# Altium schematic sheet FULL_CB_Plugs_REV_D.SchDoc
size A4; DrawnBy: Philip Rowse
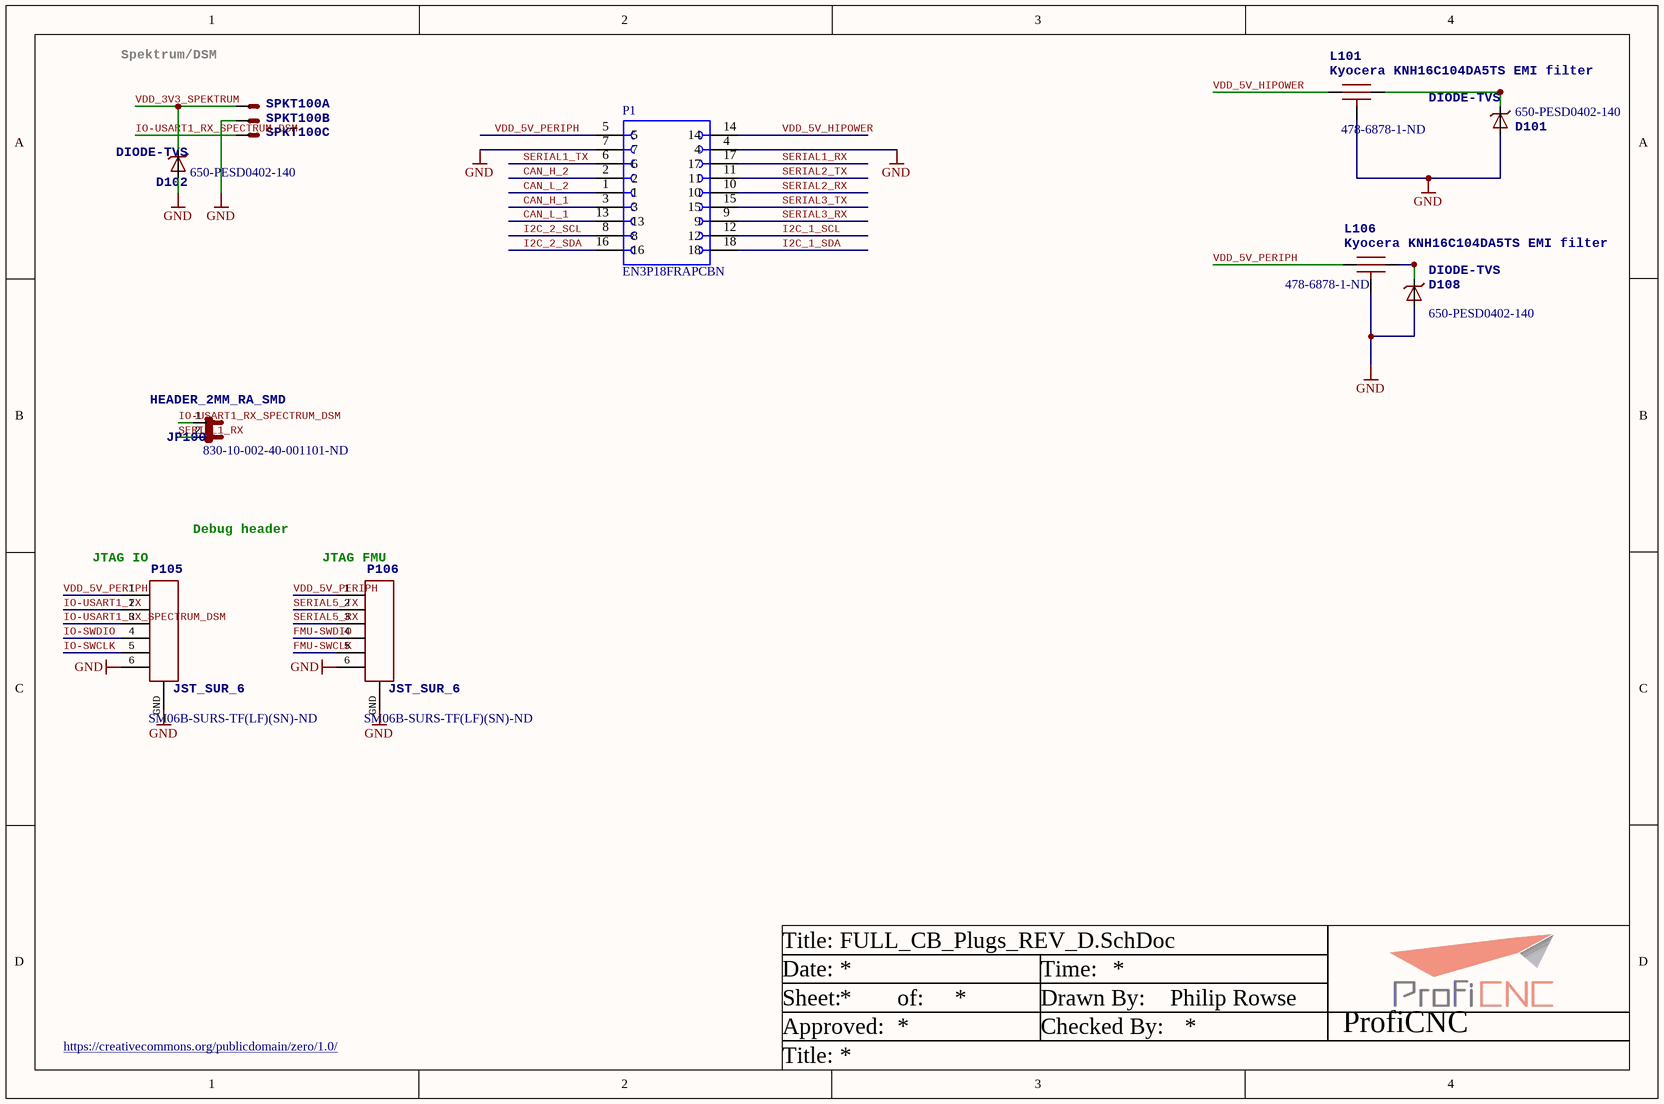
[diagram p0: FULL_CB_Plugs_REV_D.SchDoc]

## Parts
D101  DIODE-TVS  Supplier Part Number 1: 650-PESD0402-140  [0402-TVS]
D102  DIODE-TVS  Supplier Part Number 1: 650-PESD0402-140  [0402-TVS]
D108  DIODE-TVS  Supplier Part Number 1: 650-PESD0402-140  [0402-TVS]
JP100  HEADER_2MM_RA_SMD  Supplier Part Number 1: 830-10-002-40-001101-ND  [HEADER_2MM_RA_2]
L101  Kyocera KNH16C104DA5TS EMI filter  Supplier Part Number 1: 478-6878-1-ND  [KYOCERA-KNH16-DA]
L106  Kyocera KNH16C104DA5TS EMI filter  Supplier Part Number 1: 478-6878-1-ND  [KYOCERA-KNH16-DA]
P1  EN3P18FRAPCBN  [SWITCHCRAFT_EN3P18FRAPCBN]
P105  JST_SUR_6  Supplier Part Number 1: SM06B-SURS-TF(LF)(SN)-ND  [JST_SUR_H6]
P106  JST_SUR_6  Supplier Part Number 1: SM06B-SURS-TF(LF)(SN)-ND  [JST_SUR_H6]
SPKT100  CONN_SPEKTRUM_RX-TH  [B3B-ZR]  (value not drawn)  (parts A,B,C of 3)

## Nets
GND: D101.A D102.A D108.A L101.GND L106.GND P1.4 P1.7 P105.6 P105.GND P106.6 P106.GND SPKT100.2(S)
CAN_H_1: P1.3
CAN_H_2: P1.2
CAN_L_1: P1.13
CAN_L_2: P1.1
FMU-SWCLK: P106.5
FMU-SWDIO: P106.4
I2C_1_SCL: P1.12
I2C_1_SDA: P1.18
I2C_2_SCL: P1.8
I2C_2_SDA: P1.16
IO-SWCLK: P105.5
IO-SWDIO: P105.4
IO-USART1_RX_SPECTRUM_DSM: JP100.1 P105.3 SPKT100.1(S)
IO-USART1_TX: P105.2
SERIAL1_RX: JP100.2 P1.17
SERIAL1_TX: P1.6
SERIAL2_RX: P1.10
SERIAL2_TX: P1.11
SERIAL3_RX: P1.9
SERIAL3_TX: P1.15
SERIAL5_RX: P106.3
SERIAL5_TX: P106.2
VDD_3V3_SPEKTRUM: D102.C SPKT100.3(S)
VDD_5V_HIPOWER: L101.P$1 P1.14
VDD_5V_PERIPH: L106.P$1 P1.5 P105.1 P106.1
NetD101_C: D101.C L101.P$2
NetD108_C: D108.C L106.P$2

## Notes on the sheet
- Spektrum/DSM
- Debug header
- (near P105) JTAG IO
- (near P106) JTAG FMU
- Title:
- Date:
- Time:
- https://creativecommons.org/publicdomain/zero/1.0/
- Sheet:
- Approved:
- of:
- Drawn By:
- Checked By:
- ProfiCNC

## Library data of the parts
D101 D102 D108 = DIODE-TVS: Diode, TVS, 14VWM, 40VC, 0402, SMD; Supplier 1: Mouser
JP100 = HEADER_2MM_RA_SMD: Connector, PCB, 2MM, 2Pos, R/A, SMD, Au; Supplier 1: Digi-Key
L101 L106 = KNH16C104DA5TS: Capacitor, Filter, 0.1uF, 25V, 2A, 0603, SMD; Supplier 1: Digi-Key
P105 P106 = JST_SUR_6: Connector, Header, 6Pos, .8mm IDC, R/A, SMD, Tin; Supplier 1: Digi-Key
SPKT100 = CONN_SPEKTRUM_RX-TH: Spektrum RX connector; JST ZH series S3B-ZR-SM4A-TF; PARTNO: B3B-ZR(LF)(SN)
P1 = EN3P18FRAPCBN: Package: None; Price: None; Value: *; MP: EN3P18FRAPCBN; Availability: Unavailable